# Altium schematic sheet fr4_light_sensor_programmer.SchDoc
size A4; SheetNumber: 1; SheetTotal: 1
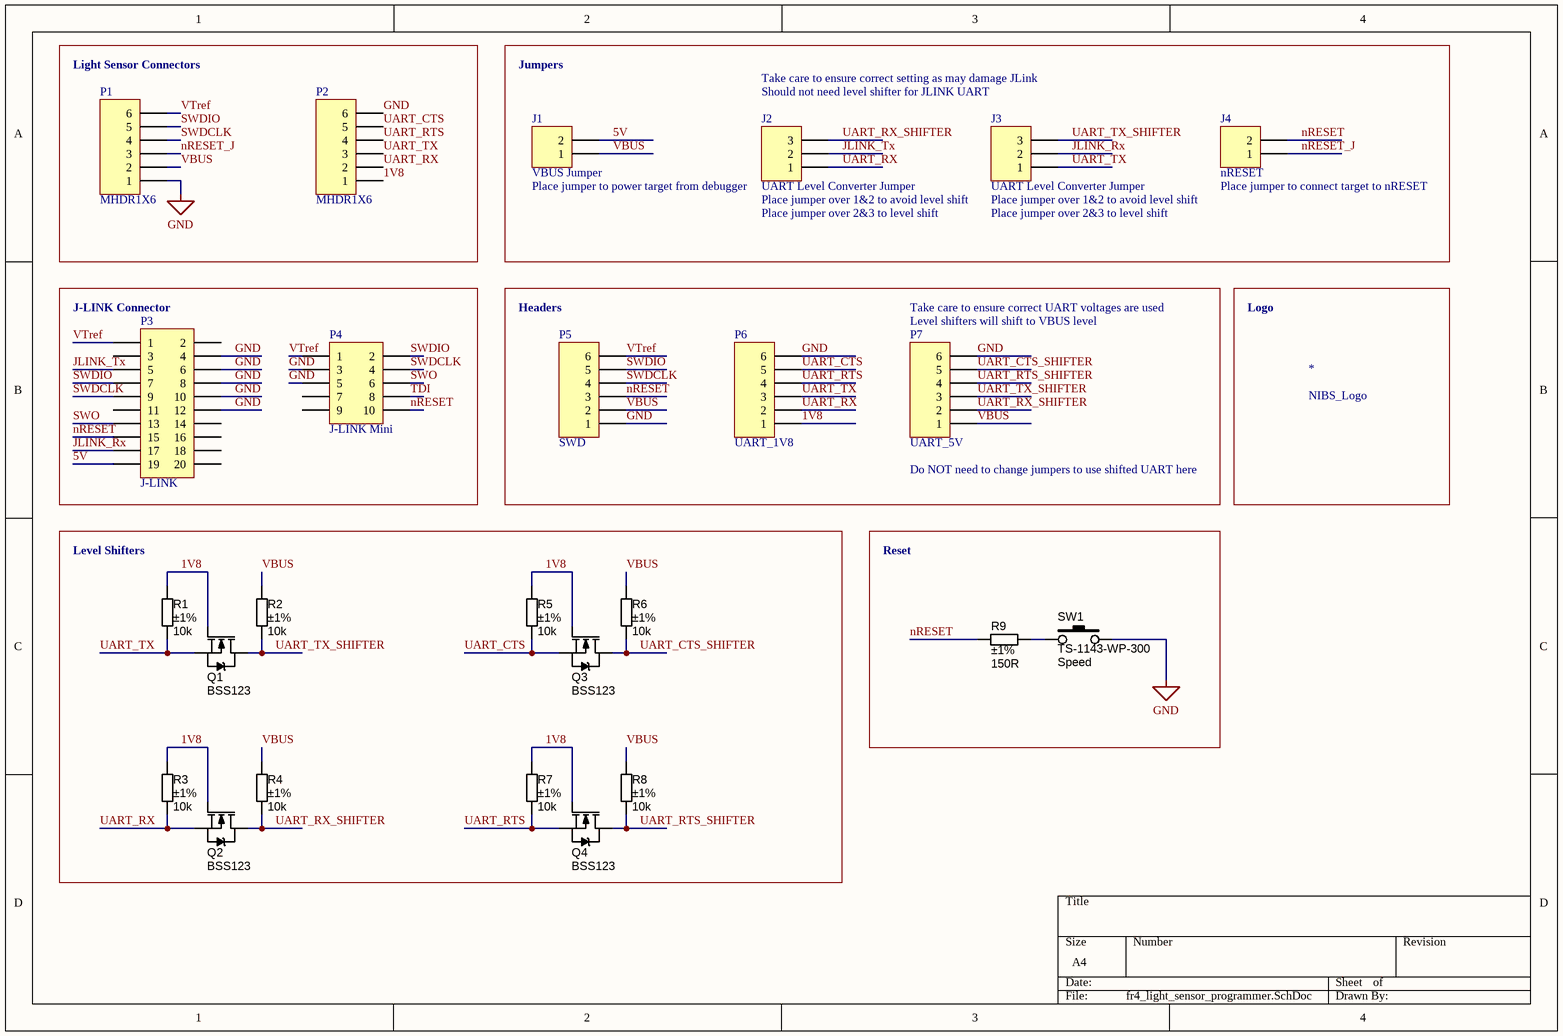
[diagram p0: fr4_light_sensor_programmer.SchDoc]

## Parts
*  NIBS_Logo  [Logo]
J1  VBUS Jumper  [HDR1X2]
J2  UART Level Converter Jumper  [HDR1X3]
J3  UART Level Converter Jumper  [HDR1X3]
J4  nRESET  [HDR1X2]
P1  MHDR1X6  [MHDR1X6]
P2  MHDR1X6  [MHDR1X6]
P3  J-LINK  [HDR2X10]
P4  J-LINK Mini  [MHDR2X5]
P5  SWD  [HDR1X6]
P6  UART_1V8  [HDR1X6]
P7  UART_5V  [HDR1X6]
Q1  BSS123  [SOT23-3]
Q2  BSS123  [SOT23-3]
Q3  BSS123  [SOT23-3]
Q4  BSS123  [SOT23-3]
R1  value 10k  Tolerance: ±1%  [RESC1608X55N]  (hidden comment: Thick Film)
R2  value 10k  Tolerance: ±1%  [RESC1608X55N]  (hidden comment: Thick Film)
R3  value 10k  Tolerance: ±1%  [RESC1608X55N]  (hidden comment: Thick Film)
R4  value 10k  Tolerance: ±1%  [RESC1608X55N]  (hidden comment: Thick Film)
R5  value 10k  Tolerance: ±1%  [RESC1608X55N]  (hidden comment: Thick Film)
R6  value 10k  Tolerance: ±1%  [RESC1608X55N]  (hidden comment: Thick Film)
R7  value 10k  Tolerance: ±1%  [RESC1608X55N]  (hidden comment: Thick Film)
R8  value 10k  Tolerance: ±1%  [RESC1608X55N]  (hidden comment: Thick Film)
R9  value 150R  Tolerance: ±1%  [RESC1608X55N]  (hidden comment: Thick Film)
SW1  Manufacturer Part Number 1: TS-1143-WP-300  Function: Speed  [TACT-SWITCH-TS1143]  (hidden comment: SW_THT_PB_4.3mm)

## Blocks framed on the sheet
Light Sensor Connectors: P1 P2
J-LINK Connector: P3 P4
Logo: *
Level Shifters: Q1-Q4 R1-R8
Reset: R9 SW1

## Nets
GND: P1.1 P2.6 P3.4 P3.6 P3.8 P3.10 P3.12 P4.3 P4.5 P5.1 P6.6 P7.6 SW1.2
1V8: P2.1 P6.1 Q1.1(G) Q2.1(G) Q3.1(G) Q4.1(G) R1.1 R3.1 R5.1 R7.1
5V: J1.2 P3.19
JLINK_Rx: J3.2 P3.17
JLINK_Tx: J2.2 P3.5
nRESET: J4.2 P3.15 P4.10 P5.3 R9.1
nRESET_J: J4.1 P1.3
SWDCLK: P1.4 P3.9 P4.4 P5.4
SWDIO: P1.5 P3.7 P4.2 P5.5
SWO: P3.13 P4.6
TDI: P4.8
UART_CTS: P2.5 P6.5 Q3.2(S) R5.2
UART_CTS_SHIFTER: P7.5 Q3.3(D) R6.2
UART_RTS: P2.4 P6.4 Q4.2(S) R7.2
UART_RTS_SHIFTER: P7.4 Q4.3(D) R8.2
UART_RX: J2.1 P2.2 P6.2 Q2.2(S) R3.2
UART_RX_SHIFTER: J2.3 P7.2 Q2.3(D) R4.2
UART_TX: J3.1 P2.3 P6.3 Q1.2(S) R1.2
UART_TX_SHIFTER: J3.3 P7.3 Q1.3(D) R2.2
VBUS: J1.1 P1.2 P5.2 P7.1 R2.1 R4.1 R6.1 R8.1
VTref: P1.6 P3.1 P4.1 P5.6
NetR9_2: R9.2 SW1.1

Not connected (* = marked no-connect by the designer): P3 2 3 11 14 16 18 20; P4 7 9

## Notes on the sheet
- Jumpers
- Take care to ensure correct setting as may damage JLink
- Should not need level shifter for JLINK UART
- Place jumper to power target from debugger
- Place jumper over 1&2 to avoid level shift
- (near J2) Place jumper over 2&3 to level shift
- (near J3) Place jumper over 2&3 to level shift
- (near J4) Place jumper to connect target to nRESET
- Headers
- (near P7) Take care to ensure correct UART voltages are used
- (near P7) Level shifters will shift to VBUS level
- (near P7) Do NOT need to change jumpers to use shifted UART here

## Library data of the parts
J1 J4 = Header 2: Header, 2-Pin; LatestRevisionDate: 17-Jul-2002; LatestRevisionNote: Re-released for DXP Platform.; Publisher: Altium Limited
J2 J3 = Header 3: Header, 3-Pin; LatestRevisionDate: 17-Jul-2002; LatestRevisionNote: Re-released for DXP Platform.; Publisher: Altium Limited
P1 P2 = MHDR1X6: Header, 6-Pin; LatestRevisionDate: 17-Jul-2002; LatestRevisionNote: Re-released for DXP Platform.; Publisher: Altium Limited
P3 = Header 10X2: Header, 10-Pin, Dual row; LatestRevisionDate: 17-Jul-2002; LatestRevisionNote: Re-released for DXP Platform.; Publisher: Altium Limited
P4 = MHDR2X5: Header, 5-Pin, Dual row; LatestRevisionDate: 17-Jul-2002; LatestRevisionNote: Re-released for DXP Platform.; Publisher: Altium Limited
P5-P7 = Header 6: Header, 6-Pin; LatestRevisionDate: 17-Jul-2002; LatestRevisionNote: Re-released for DXP Platform.; Publisher: Altium Limited
Q1-Q4 = MOSFET_BSS123: MOSFET SMD N-CH 100V 170mA SOT23-3; Manufacturer 1: Diodes Inc; Manufacturer Part Number 1: BSS123-7-F; Ratings: 100V; 170mA; Material: Metal Oxide; SCDType: source; Package / Case: SOT23-3; Supplier 1: Digi-Key; Supplier Part Number 1: BSS123-FDICT-ND
R1-R9 = RES_10K_0603_1%: Resistor SMD chip 10k Ohm 0.1W 1% 0603; Manufacturer 1: Yageo; Manufacturer Part Number 1: RC0603FR-0710KL; Ratings: 1/10W; SCDType: spec; Package / Case: 0603 (1608 Metric); Supplier 1: Digi-Key; Supplier Part Number 1: 311-10.0KHRCT-ND
SW1 = SW_THT_PB_4.3mm: Switch, tact, 4.3mm stem; Manufacturer 1: Bond-Tact; SCDType: spec; Package / Case: 6.5x6.5mm; 4.3mm stem; Material: Brass/Nylon/Ag plating